# EAGLE design SAML21 Feather (EAGLE 9.4.2)
COMPANY: ADAFRUIT INDUSTRIES; DRAWN: KTOWN; REV: B
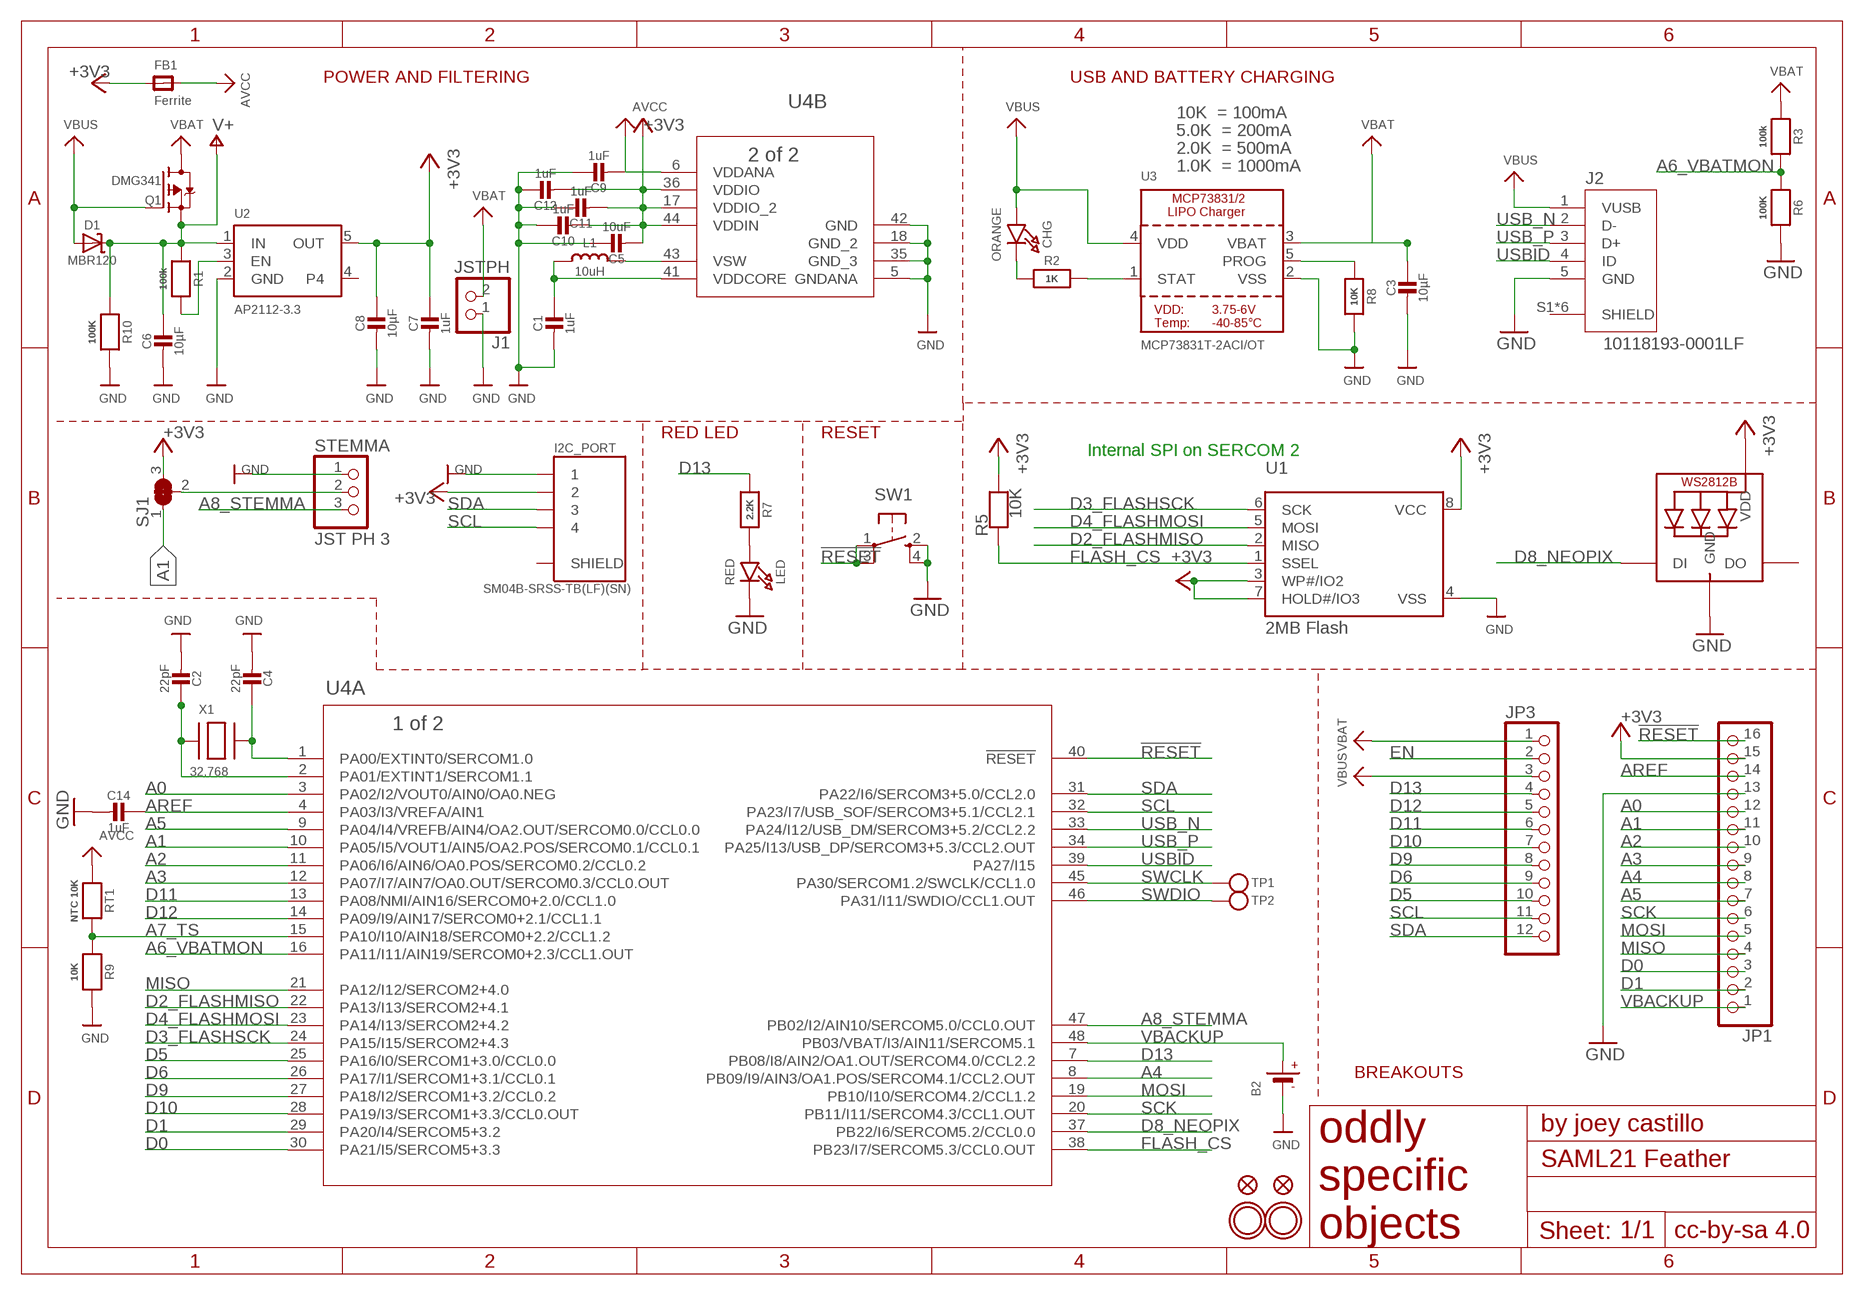
[diagram p0: schematic, sheet 1]

## Parts
B2  CR1220  BATTERYCR1220_2  [CR1220-2]
C1  1uF  CAP_CERAMIC0805-NOOUTLINE  [0805-NO]
C2  22pF  CAP_CERAMIC0805-NOOUTLINE  [0805-NO]
C3  10µF  CAP_CERAMIC0805-NOOUTLINE  [0805-NO]
C4  22pF  CAP_CERAMIC0805-NOOUTLINE  [0805-NO]
C5  10uF  CAP_CERAMIC0805-NOOUTLINE  [0805-NO]
C6  10µF  CAP_CERAMIC0805-NOOUTLINE  [0805-NO]
C7  1uF  CAP_CERAMIC0805-NOOUTLINE  [0805-NO]
C8  10µF  CAP_CERAMIC0805-NOOUTLINE  [0805-NO]
C9  1uF  CAP_CERAMIC0805-NOOUTLINE  [0805-NO]
C10  1uF  CAP_CERAMIC0805-NOOUTLINE  [0805-NO]
C11  1uF  CAP_CERAMIC0805-NOOUTLINE  [0805-NO]
C12  1uF  CAP_CERAMIC0805-NOOUTLINE  [0805-NO]
C14  1uF  CAP_CERAMIC0805-NOOUTLINE  [0805-NO]
CHG  ORANGE  LED0805_NOOUTLINE  [CHIPLED_0805_NOOUTLINE]
D1  MBR120  DIODE-SCHOTTKYSOD-123  [SOD-123]
FB1  Ferrite  FERRITE0805  [0805]
I2C_PORT  SM04B-SRSS-TB(LF)(SN)  [JST_SM04B-SRSS-TB(LF)(SN)]
J1  JSTPH  CON_JST_PH_2PIN  [JSTPH2]
J2  10118193-0001LF  [FCI_10118193-0001LF]
JP1  HEADER-1X16ROUND  [1X16_ROUND]
JP3  HEADER-1X12  [1X12_ROUND]
L1  10uH  MICROBUILDER_INDUCTORNR401_BIGPADS  [MICROBUILDER_INDUCTOR_4X4MM_NR401_BIGPADS]
LED  RED  LED0805_NOOUTLINE  [CHIPLED_0805_NOOUTLINE]
NEOPIX  WS2812B3535  [LED3535]
Q1  DMG341  MOSFET-P  [SOT23-R]
R1  100k  RESISTOR0805_NOOUTLINE  [0805-NO]
R2  1K  RESISTOR0805_NOOUTLINE  [0805-NO]
R3  100k  RESISTOR0805_10MGAP  [0805_10MGAP]
R5  10K  RESISTOR0805_NOOUTLINE  [0805-NO]
R6  100K  RESISTOR0805_NOOUTLINE  [0805-NO]
R7  2.2K  RESISTOR0805_NOOUTLINE  [0805-NO]
R8  10K  RESISTOR0805_NOOUTLINE  [0805-NO]
R9  10K  RESISTOR0805_NOOUTLINE  [0805-NO]
R10  100K  RESISTOR0805_NOOUTLINE  [0805-NO]
RT1  NTC 10K  RESISTOR0805_NOOUTLINE  [0805-NO]
SJ1  SOLDERJUMPER_2WAY  [SOLDERJUMPER_2WAY_OPEN_NOPASTE]
STEMMA  JST PH 3  CON_JST_PH_3PIN  [JSTPH3]
SW1  SPST_TACT-KMR2  [KMR2]
TP1  TESTPOINTROUND1.5MM  [TESTPOINT_ROUND_1.5MM]
TP2  TESTPOINTROUND1.5MM  [TESTPOINT_ROUND_1.5MM]
U1  2MB Flash  SPIFLASH_SOIC8208MIL  [SOIC8_208MIL]
U2  AP2112-3.3  VREG_SOT23-5  [SOT23-5]
U3  MCP73831T-2ACI/OT  MCP73831/2  [SOT23-5]
U4  ATSAML21G16B-ANT  [TQFP48_7X7MC]
U$31  MOUNTINGHOLE2.5  [MOUNTINGHOLE_2.5_PLATED]
U$32  MOUNTINGHOLE2.5  [MOUNTINGHOLE_2.5_PLATED]
U$34  FIDUCIAL""  [FIDUCIAL_1MM]
U$35  FIDUCIAL""  [FIDUCIAL_1MM]
X1  32.768  XTAL-3.2X1.5  [XTAL3215]

## Nets
!RESET: JP1.16 SW1.1(P) SW1.3(P1) U4.40(A:!RESET)
+3V3 [power]: C5.2 C7.1 C8.1 C10.2 C11.2 C12.2 FB1.1 I2C_PORT.2 JP1.15 NEOPIX.2(VDD) R5.2 SJ1.3 U1.3(WP#/IO2) U1.7(HOLD#/IO3) U1.8(VCC) U2.5(OUT) U4.17(B:VDDIO_2) U4.36(B:VDDIO) U4.44(B:VDDIN)
A0: JP1.12 U4.3(A:PA02/I2/VOUT0/AIN0/OA0.NEG)
A1: JP1.11 SJ1.1 U4.10(A:PA05/I5/VOUT1/AIN5/OA2.POS/SERCOM0.1/CCL0.1)
A2: JP1.10 U4.11(A:PA06/I6/AIN6/OA0.POS/SERCOM0.2/CCL0.2)
A3: JP1.9 U4.12(A:PA07/I7/AIN7/OA0.OUT/SERCOM0.3/CCL0.OUT)
A4: JP1.8 U4.8(A:PB09/I9/AIN3/OA1.POS/SERCOM4.1/CCL2.OUT)
A5: JP1.7 U4.9(A:PA04/I4/VREFB/AIN4/OA2.OUT/SERCOM0.0/CCL0.0)
A6_VBATMON: R3.2 R6.1 U4.16(A:PA11/I11/AIN19/SERCOM0+2.3/CCL1.OUT)
A7_TS: R9.1 RT1.2 U4.15(A:PA10/I10/AIN18/SERCOM0+2.2/CCL1.2)
A8_STEMMA: STEMMA.3 U4.47(A:PB02/I2/AIN10/SERCOM5.0/CCL0.OUT)
AREF: C14.1 JP1.14 U4.4(A:PA03/I3/VREFA/AIN1)
AVCC: C9.2 FB1.2 RT1.1 U4.6(B:VDDANA)
D0: JP1.3 U4.30(A:PA21/I5/SERCOM5+3.3)
D1: JP1.2 U4.29(A:PA20/I4/SERCOM5+3.2)
D2_FLASHMISO: U1.2(MISO) U4.22(A:PA13/I13/SERCOM2+4.1)
D3_FLASHSCK: U1.6(SCK) U4.24(A:PA15/I15/SERCOM2+4.3)
D4_FLASHMOSI: U1.5(MOSI) U4.23(A:PA14/I13/SERCOM2+4.2)
D5: JP3.10 U4.25(A:PA16/I0/SERCOM1+3.0/CCL0.0)
D6: JP3.9 U4.26(A:PA17/I1/SERCOM1+3.1/CCL0.1)
D8_NEOPIX: NEOPIX.1(DI) U4.37(A:PB22/I6/SERCOM5.2/CCL0.0)
D9: JP3.8 U4.27(A:PA18/I2/SERCOM1+3.2/CCL0.2)
D10: JP3.7 U4.28(A:PA19/I3/SERCOM1+3.3/CCL0.OUT)
D11: JP3.6 U4.13(A:PA08/NMI/AIN16/SERCOM0+2.0/CCL1.0)
D12: JP3.5 U4.14(A:PA09/I9/AIN17/SERCOM0+2.1/CCL1.1)
D13: JP3.4 R7.1 U4.7(A:PB08/I8/AIN2/OA1.OUT/SERCOM4.0/CCL2.2)
EN: JP3.2 R1.2 U2.3(EN)
FLASH_CS: R5.1 U1.1(SSEL) U4.38(A:PB23/I7/SERCOM5.3/CCL0.OUT)
GND [gnd]: B2.- C1.2 C2.2 C3.2 C4.2 C5.1 C6.2 C7.2 C8.2 C9.1 C10.1 C11.1 C12.1 C14.2 I2C_PORT.1 J1.1 J2.5(GND) JP1.13 LED.C NEOPIX.4(GND) R6.2 R8.2 R9.2 R10.2 STEMMA.1 SW1.2(S) SW1.4(S1) U1.4(VSS) U2.2(GND) U3.2(VSS) U4.5(B:GNDANA) U4.18(B:GND_2) U4.35(B:GND_3) U4.42(B:GND)
MISO: JP1.4 U4.21(A:PA12/I12/SERCOM2+4.0)
MOSI: JP1.5 U4.19(A:PB10/I10/SERCOM4.2/CCL1.2)
N$1: CHG.C R2.1
N$2: LED.A R7.2
N$3: SJ1.2 STEMMA.2
PROG: R8.1 U3.5(PROG)
SCK: JP1.6 U4.20(A:PB11/I11/SERCOM4.3/CCL1.OUT)
SCL: I2C_PORT.4 JP3.11 U4.32(A:PA23/I7/USB_SOF/SERCOM3+5.1/CCL2.1)
SDA: I2C_PORT.3 JP3.12 U4.31(A:PA22/I6/SERCOM3+5.0/CCL2.0)
STAT: R2.2 U3.1(STAT)
SWCLK: TP1.P$1 U4.45(A:PA30/SERCOM1.2/SWCLK/CCL1.0)
SWDIO: TP2.P$1 U4.46(A:PA31/I11/SWDIO/CCL1.OUT)
USB_N: J2.2(D-) U4.33(A:PA24/I12/USB_DM/SERCOM3+5.2/CCL2.2)
USB_P: J2.3(D+) U4.34(A:PA25/I13/USB_DP/SERCOM3+5.3/CCL2.OUT)
USBID: J2.4(ID) U4.39(A:PA27/I15)
V+ [power]: C6.1 D1.C Q1.2(S) R1.1 R10.1 U2.1(IN)
VBACKUP: B2.+ JP1.1 U4.48(A:PB03/VBAT/I3/AIN11/SERCOM5.1)
VBAT [power]: C3.1 J1.2 JP3.1 Q1.3(D) R3.1 U3.3(VBAT)
VBUS [power]: CHG.A D1.A J2.1(VUSB) JP3.3 Q1.1(G) U3.4(VDD)
VDDCORE: C1.1 L1.P$1 U4.41(B:VDDCORE)
VSW: L1.P$2 U4.43(B:VSW)
XIN32: C4.1 U4.1(A:PA00/EXTINT0/SERCOM1.0) X1.P$2
XOUT32: C2.1 U4.2(A:PA01/EXTINT1/SERCOM1.1) X1.P$1
Unconnected: I2C_PORT.S1(SHIELD) I2C_PORT.S2(SHIELD) J2.S1(SHIELD) J2.S2(SHIELD) J2.S3(SHIELD) J2.S4(SHIELD) J2.S5(SHIELD) J2.S6(SHIELD) NEOPIX.3(DO) U2.4

## Notes on the sheet
- POWER AND FILTERING | USB AND BATTERY CHARGING
- 10K  = 100mA
- 5.0K  = 200mA
- 2.0K  = 500mA
- 1.0K  = 1000mA
- RED LED | RESET
- Internal SPI on SERCOM 2
- BREAKOUTS

## Library data of the parts
B2 = microbuilder:BATTERY: CR1220 SMT - Digikey: 3001K-ND CD2032 BAT-HLD-001 - Digikey: BAT-HLD-001-ND
C1-C12 C14 = microbuilder:CAP_CERAMIC: Ceramic Capacitors For new designs, use the packages preceded by an '_' character since they are more reliable: The following footprints should be used on most boards: _0402 - Standard footprint for regular board layouts _0603 - Standard footprint for regular board layouts _0805 - Standard footprint for regular board layouts _1206 - Standard footprint for regular board layouts For extremely tight-pitch boards where space is at a premium, the following 'micro-pitch' footprints can be used (smaller pads, no silkscreen outline, etc.): _0402MP - Micro-pitch footprint for very dense/compact boards _0603MP - Micro-pitch footprint for very dense/compact boards _0805MP - Micro-pitch footprint for very dense/compact boards _1206MP - Micro-pitch footprint for very dense/compact boards
CHG LED = microbuilder:LED: LED 0603 - 0603 Surface Mount Package 2mA: Green LED - Low Power (3.9mcd, 2ma, 1.7Vf) - Digikey: 475-2709-2-ND Orange LED - Low Power (9.8mcd, 2ma, 1.8Vf) - Digikey: 475-1194-2-ND Red LED - Low Power (5mcd, 2ma, 1.8Vf) - Digikey: 475-1195-2-ND Yellow LED - Low Power (7mcd, 2ma, 1.8Vf) - Digikey: 475-1196-2-ND 5mA: Blue LED - Low Power (17mcd, 5ma, 2.9Vf) - Digikey: LNJ937W8CRACT-ND 0805 - 0805 Surface Mount Package 2mA: Red LED (8.8mcd, 2mA, 1.8Vf, Clear) - Low Power [Digikey: 475-2510-1-ND] Green LED (5mcd, 2mA, 1.8Vf, Clear) - Low Power [Digikey: 475-2730-1-ND] Yellow LED (11.3mcd, 2mA, 1.8Vf, Clear) - Low Power [Digikey: 475-2555-1-ND] 20mA: Red LED (104mcd, 20mA, Diffused) - LS R976 [Digikey: 475-1278-6-ND] Red LED (12mcd, 20mA, 2.0Vf, Clear) - APT2012EC [Digikey: 754-1128-1-ND] Green LED (15mcd, 20mA, 2.2Vf, Clear) - APT2012GC [Digikey: 754-1131-1-ND] Orange LED (160mcd, 20mA, 2.1Vf, Clear) - APT2012SECK [Digikey: 754-1130-1-ND] 1206 - 1206 Surface Mount Package Green LED (26mcd, 20mA, Diffused) - LG N971 [Digikey: 475-1407-6-ND] Red LED (15mcd, 20mA, Diffused) - LH N974 [Digikey: 475-1416-6-ND] Cree - Cree High-Power Surface Mount LEDs XPEBWT-L1-0000-00D50 - White 111lm 350mA 2.9Vf 6200K 110° XTEAWT-00-0000-00000LEE3 - White 114lm 350mA 2.85Vf 5000K 115° Everlight - Everlight 45-21 Series Surface Mount LEDs 45-21/QK2C-B2832AC2CB2/2T - Warm White 2000mcd 20mA 3.25Vf 3050K 120° 45-21/LK2C-B38452C4CB2/2T - Nuetral White 2000mcd 20mA 3.25Vf 4150K 120° 45-21/LK2C-B50634C6CB2/2T - Cold White 2200mcd 20mA 3.25Vf 5650K 120° PLCC2 Reverse Mount LS T77K-J1L2-1-0-2-R18-Z - Red 11.25mcd 2mA 1.8Vf 630nm 120° LO T77K-L1M2-24-Z - Orange 19.6mcd 2mA 1.8Vf 606nm 120° LY T77K-K2M1-26-Z - Yellow 15.7mcd 2mA 1.8Vf 587nm 120°
D1 = microbuilder:DIODE-SCHOTTKY
FB1 = microbuilder:FERRITE: Ferrite Bead 0603 MMZ1608B121C - 120 Ohm @ 100MHz, 600mA, 0.15 Ohm DC Resistance - Digikey: 445-2164-1-ND BK1608HW121-T - 120 Ohm, 600mA Ferrite Chip - Digikey: 587-1876-2-ND 0805 HZ0805B272R-10 - 2.7K Ohm @ 100MHz, 200mA, 0.8 Ohm DC Resistance - Digikey: 240-2504-1-ND (see also Murata BLM21BD272SN1L) MMZ2012Y152B - 1.5K Ohm @ 100MHz, 500mA, 0.4 Ohm DC Resistance - Digikey: 445-1560-1-ND - Mainly for high frequency (80-400MHz) MMZ2012R102A - 1K Ohm @ 100MHz, 500mA, 0.3 Ohm DC Resistance - Digikey: 445-1555-2-ND - More general purpose (10-200MHz)
I2C_PORT = SM04B-SRSS-TB_LF__SN_:SM04B-SRSS-TB(LF)(SN): SH Series 1.0 mm Pitch 2 Position Single Row Side Entry Shrouded Header; DESCRIPTION: SH Series 1.0 mm Pitch 2 Position Single Row Side Entry Shrouded Header; DIGI-KEY_PART_NUMBER: 455-1804-1-ND; DIGI-KEY_PURCHASE_URL: https://www.digikey.com/product-detail/en/jst-sales-america-inc/SM04B-SRSS-TB_LF__SN_/455-1804-1-ND/926875?utm_source=snapeda&utm_medium=aggregator&utm_campaign=symbol; MF: JST Sales; MP: SM04B-SRSS-TB_LF__SN_; PACKAGE: None
J1 = microbuilder:CON_JST_PH_2PIN: JST 2-Pin Right-Angle Connector PH-Series - 4UConnector: 17311 SH-Series - 4UConnector: 07278
J2 = 10118193-0001LF:10118193-0001LF: Micro USB B Type Receptacle; DESCRIPTION: Single Port 5 Contact Shielded SMT MICRO USB B-Type Receptacle; DIGI-KEY_PART_NUMBER: 609-4616-1-ND; DIGI-KEY_PURCHASE_URL: https://www.digikey.com/product-detail/en/amphenol-icc-fci/10118193-0001LF/609-4616-1-ND/2785380?utm_source=snapeda&utm_medium=aggregator&utm_campaign=symbol; MF: Amphenol ICC; MP: 10118193-0001LF; PACKAGE: None
JP1 = microbuilder:HEADER-1X16: PIN HEADER
JP3 = microbuilder:HEADER-1X12
L1 = Adafruit 3.5in 480x320 FeatherWing:MICROBUILDER_INDUCTOR: Inductors 0603: 10nH Ceramic Inductor - microwire antenna/RF (Digikey: 712-1434-2-ND) 0805: 560nH Ceramic Inductor - RF (Digikey: 553-1047-1-ND) 270nH Ceramic Inductor - Q = 40@250MHz, +-5%, 1 Ohm DC Resistance (Digikey: 535-10506-2-ND) 1007 (2518 Metric) SMT: 10µH 10% 250mOhm 820mA 1007 Inductor (Digikey: 587-2189-1-ND) 22µH 10% 500mOhm 580mA 1007 Inductor (Digikey: 587-2190-1-ND) 47µH 10% 950mOhm 420mA 1007 Inductor (Digikey: 587-2191-1-ND) 47µH 5% 100mOhm 1A 1008 Inductor (Digikey: 732-1816-1-ND) 5.0x5.0mm (Taiyo Yuden NR5040 Series) 6.8µH 20% 2.3A 64mOhm Inductor (Digikey: 587-2374-2-ND) 5.0x5.0mm (TDK VLC5045 Series) 4.7µH 20% 3.3A 34mOhm Inductor (Digikey: 445-6526-1-ND) 6.8µH 20% 2.7A 46mOhm Inductor (Digikey: 445-6527-1-ND) 6.0x6.0mm (TDK VLC6045 Series) 4.7µH 20% 3.8A 27mOhm Inductor (Digikey: 445-6538-2-ND) 6.8µH 20% 3A 41mOhm Inductor (Digikey: 445-6540-1-ND) 6.2µH 30% 2.2A 45mOhm Inductor (Digikey: SRR5028-6R2YCT-ND) - Not TDK VLC6045 but footprint should match 6.0x6.0mm (TDK SLF6045 Series) 6.8uH 30% 2A 33mOhm Inductor (Digikey: 445-4572-1-ND, Mouser: 810-SLF645T6R8N2R0PF) 6.0x6.0mm (Sumida CDRH5D28 Series) 6.2uH 30% 1.8A 45mOhm Inductor (Digikey: 308-1542-1-ND) Taiyo Yuden NR3015T2R2M - 2.2uH 20% 1.5A (Digikey: 587-1648-2-ND, Mouser: 963-NR3015T2R2M) - Used with TI TPS62172 CoilCraft RFID Transponder Coil - MA5532-AE (For use with AS3935 Lightning Sensor) Taiyo Yuden NRH2412T2R2MNGH - 2.2uH 20% 1AA (Digikey: 587-3443-1-ND) - Used with TI LM3671 Vishay IHLP 1.0uH Molded Inductor - 24mOhm DCR, 5A, +/-20%, -55°C-125°C (Digikey: 541-1319-1-ND)
NEOPIX = microbuilder:WS2812B
Q1 = microbuilder:MOSFET-P: P-Channel Mosfet LEGEND VDS: Voltage Drain-Source ID: Drain Current RDS(ON): Drain-Source On-State Resistance VGS(TH): Gate-Source Threshold Voltage CISS: Drain-Source Input Capacitance SOT-23 Name VDS ID RDS(ON) VGS(TH) CISS Order Number IRLML5103 30V 760mA 600 mOhm -- 75pF @ 25V Digikey: IRLML5103PBFCT-ND IRLML6401 12V 4.3A 50 mOhm 950mV @ 250µA 830pF @ 10V Digikey: IRLML6401PBFTR-ND NTR0202PL 20V 400mA 800 mOhm 2.3V @ 250uA 70pF @ 5V Digikey: NTR0202PLT1GOSTR-ND NTR4101PT1G 20V 1.8A 85 mOhm 1.2V @ 250uA 675pF @ 10V Digikey: NTR4101PT1GOSCT-ND DMP2004K 20V 600mA 900 mOhm 1V @ 250uA 175pF @ 16V Digikey: DMP2004KDICT-ND PMV65XP 20V 3.9A 76 mOhm 950mV @ 1mA 725pF @ 20V Digikey: 568-2358-2-ND TO-252 Name VDS ID RDS(ON) VGS(TH) CISS Order Number AOD417 30V 25A 34 mOhm 3V @ 250µA 920pF @ 15V Digikey: 785-1106-2-ND PowerPak Name VDS ID RDS(ON) VGS(TH) CISS Order Number AON7401 30V 12A 14 mOhm 3V @ 250µA 2600pF @ 15V Digikey: 785-1302-1-ND
R1-R3 R5-R10 RT1 = microbuilder:RESISTOR: Resistors For new designs, use the packages preceded by an '_' character since they are more reliable: The following footprints should be used on most boards: _0402 - Standard footprint for regular board layouts _0603 - Standard footprint for regular board layouts _0805 - Standard footprint for regular board layouts _1206 - Standard footprint for regular board layouts For extremely tight-pitch boards where space is at a premium, the following 'micro-pitch' footprints can be used (smaller pads, no silkscreen outline, etc.): _0402MP - Micro-pitch footprint for very dense/compact boards _0603MP - Micro-pitch footprint for very dense/compact boards _0805MP - Micro-pitch footprint for very dense/compact boards _1206MP - Micro-pitch footprint for very dense/compact boards
SJ1 = pygamer-microbuilder:SOLDERJUMPER_2WAY: 2-Way Solder Jumper
STEMMA = microbuilder:CON_JST_PH_3PIN
SW1 = adafruit:SPST_TACT: SMT 6mm switch, EVQQ2 series http://www.ladyada.net/library/eagle
TP1 TP2 = microbuilder:TESTPOINT: Test Point Various test points for characterisation and PCB testing TESTPOINT_SMT - Compact Surface Mount Test Point [Digikey: 5016KTR-ND]
U1 = microbuilder:SPIFLASH_SOIC8: SOIC8 SPI Flash Be careful with the size since SOIC8 flash comes in several 'widths' SOIC8 150 mil M25P16 - 16Mbit (2Mbit x 8) Serial Flash (75MHz SPI Bus), Supply: 2.7-3.6V Digikey: SOIC8 - M25P16-VMN6P-ND SOIC8 208 mil W25Q16BVSSIG - 16Mbit (2Mbit x 8) Serial Flash (104MHz SPI Bus), Supply: 2.7-3.6V Digikey: SOIC8 - W25Q16BVSSIG-ND
U2 = microbuilder:VREG_SOT23-5: SOT23-5 Fixed Voltage Regulators Part Current Out V Out V In V Dropout θJA (°C/W) TJ (°C) Digikey Part No. ADP121 150mA 3.3V 3.4-5.5V 0.09V @ 150mA -- -- ADP121-AUJZ33R7CT-ND ADP121 150mA 3.0V 3.1-5.5V 0.09V @ 150mA -- -- ADP121-AUJZ30R7CT-ND ADP122 300mA 3.3V 3.4-5.5V 0.085V @ 300mA -- -- ADP122AUJZ-3.3-R7CT-ND ADP1712 300mA 3.3V 3.5-5.5V 0.17V @ 300mA -- -- ADP1712AUJZ-3.3-R7TR-ND AP7311 (Low Cost) 150mA 3.3V 3.5-6V 0.15V @ 150mA -- -- AP7311-33WG-7DICT-ND LD39015M18R 150mA 1.8V 1.9V-5.5V 0.08V @ 100mA -- -- 497-6977-1-ND LP2985A-33DBVR 150mA 3.3V 3.3-16V 0.28V @ 150mA 206 150 296-18479-1-ND MCP1824T-3302E/OT 300mA 3.3V 3.5V-6V 0.2V @ 300mA -- -- MCP1824T-3302E/OTCT-ND MIC5205-2.5YM5 TR 150mA 2.5V 2.7-16V 0.165V @ 150mA -- -- 576-1257-2-ND MIC5205-3.0YM5 TR 150mA 3.0V 3.2V-16V 0.165V @ 150mA -- -- 576-1258-2-ND MIC5205-3.3YM5 TR 150mA 3.3V 3.5V-16V 0.165V @ 150mA -- -- 576-1259-2-ND TPS780330220 150mA 3.3V+2.2V 3.6-5.5V 250mV Max -- -- 296-23332-1-ND TDA3663/N1,135 100mA 3.3V 3.5-45V 0.18V @ 50mA -- -- 568-5343-1-ND Max operating temp can be calculated using θJA, TJ (max junction temperature), and power in watts. Set the "Maximum Ambient Temperature" until it reaches TJ ("Max Junction Temperature"), which is the absolute limit for safe use of the regulator: Heat Sink Temperature Calculator <http://www.daycounter.com/Calculators/Heat-Sink-Temperature-Calculator.phtml> For example, With 12V source into a 3.3V LP2985 and a 30mA load, we are dissipating (12V-3.3V) * 0.03A = 0.261W. With a θJA of 206 °C/W, a TJ of 150°C, and 261mW we can safely use the chip without a heat sink up to 75°C (=147.1°C Junction Temperature).
U3 = microbuilder:MCP73831/2: MCP73831/2 LIPO Charger VDD: 3.75 - 6V Temp -40 - 85°C Programmable Charge Rate: 15-500mA NOTE: STAT is a tri-state logic output on the MCP73831 and an open-drain output on the MCP73832. SOT23-5 with 4.2V output and tri-state logic on STAT = MCP73831T-2ACI/OT
U4 = My Stuff:ATSAML21G16B-ANT; BUILT_BY: EMA_Molly; COPYRIGHT: Copyright (C) 2018 Accelerated Designs. All rights reserved; MANUFACTURER_PART_NUMBER: ATSAML21G16B-ANT; VENDOR: Microchip
U$31 U$32 = microbuilder:MOUNTINGHOLE: Mounting Hole For #2 screws (0.086"/2.18mm width, 0.094"/2.4mm hole) use 2.5mm; BOM: EXCLUDE
U$34 U$35 = microbuilder:FIDUCIAL: Fiducial Alignment Points Various fiducial points for machine vision alignment.; BOM: EXCLUDE
X1 = adafruit2:XTAL: Low cost SMT crystals, no capacitors included http://www.ladyada.net/library/eagle

## Net classes
0 default: width 0.152 mm, drill 0.254 mm
1 power: width 0.305 mm, drill 0.305 mm

## Board
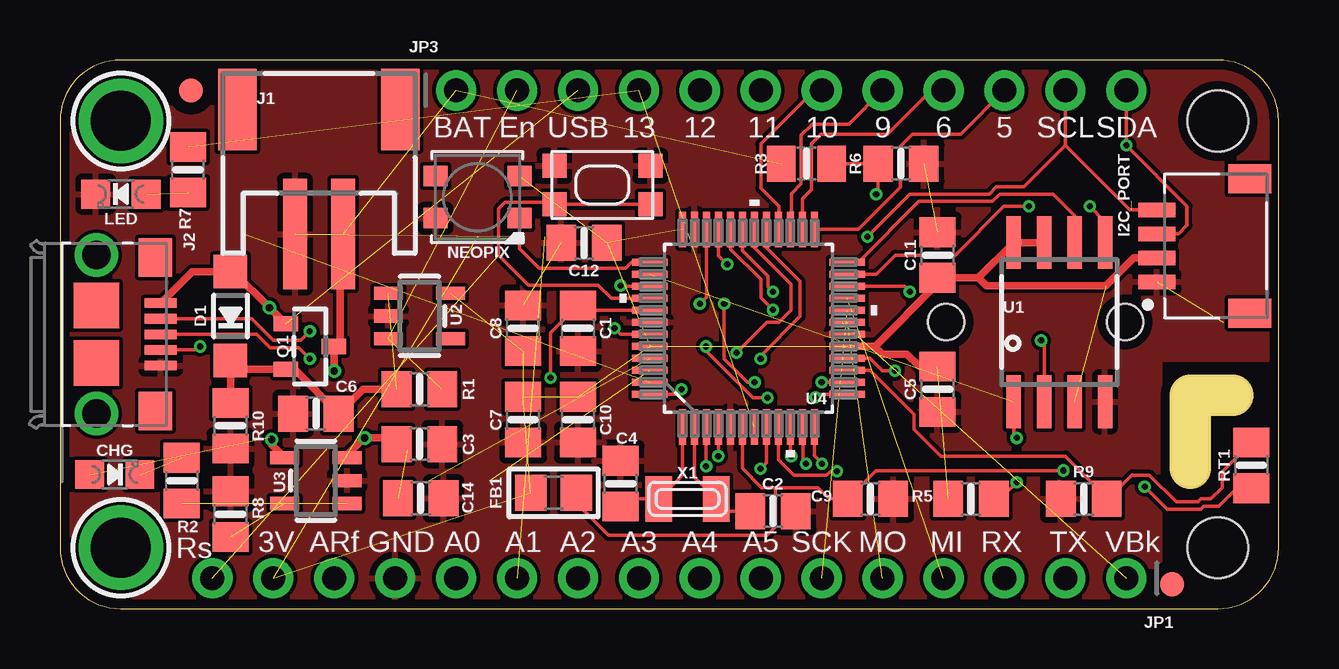
[diagram p1: board, top side]
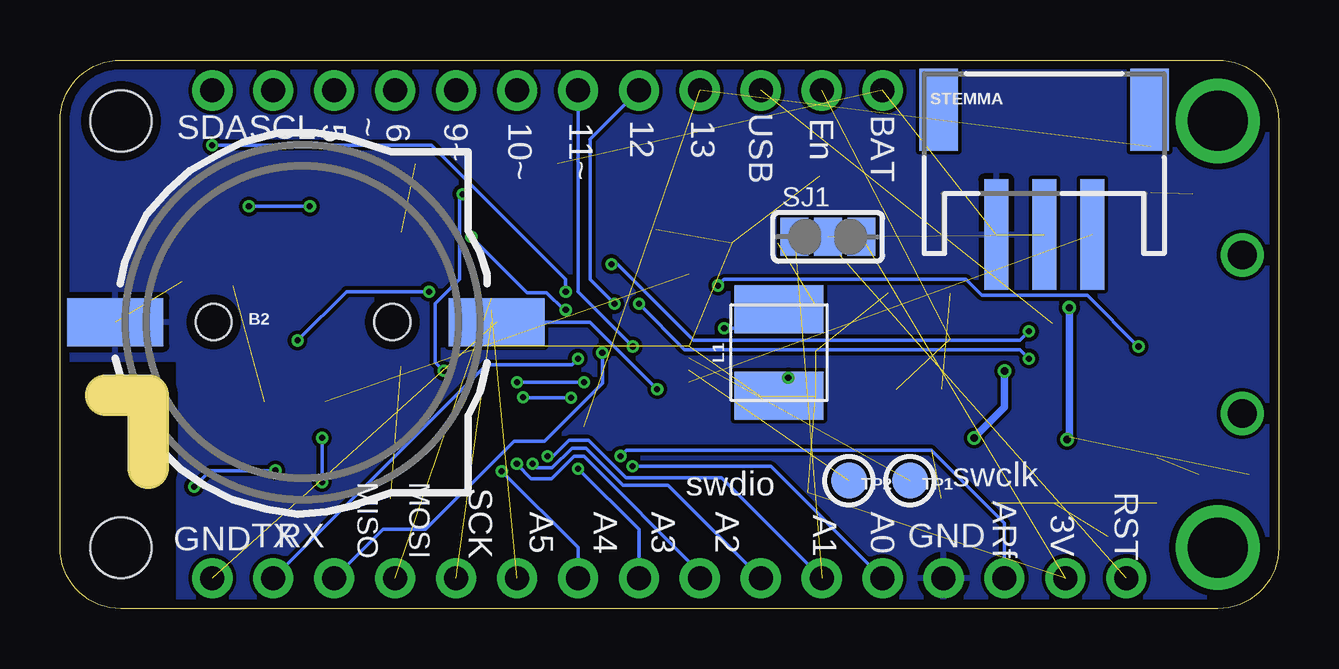
[diagram p2: board, bottom side, seen from below]

Size 50.8 x 22.86 mm. Coordinates in mm from the lower left corner, seen from the top.
Outline: 47.12,5.84 47.12,8.89 48.9,8.89
Outline: 2.54,0 48.26,0 arc90 50.8,2.54 50.8,20.32 arc90 48.26,22.86 2.54,22.86 arc90 0,20.32 0,2.54 arc90 2.54,0
Copper layers (1*16): Top 0.035559375mm / dielectric 1.6mm / Bottom 0.035559375mm
Design rules "oshpark-2layer": minimum track width 6mil, minimum drill 10mil, track to track 6mil, track to pad 6mil, pad to pad 6mil, via to via 6mil, smd to smd 6mil, copper to edge 15mil, drill to drill 6mil, minimum pad ring 5mil, minimum via ring 5mil, stop-mask expansion 2.5mil, vias tented up to drill 0mil, thermal gap 10mil
Holes 2.54 mm at 48.26,20.32 48.26,2.54
Milling: 2 lines

### Footprints (pad centres in the part's own frame; a part is rotated, then mirrored left to right if it is on the bottom)
CR1220-2 = smd 4 x 2: + 8.29,0; - -7.6,0 | hole 1.5: 3.95,0; -3.5,0
0805-NO = smd 1.24 x 1.5: 1 -0.95,0; 2 0.95,0
CHIPLED_0805_NOOUTLINE = smd 1.2 x 1.2: A 0,-1.05; C 0,1.05
SOD-123 = smd 1.4 x 1.4: A 1.85,0; C -1.85,0
0805 = smd 1.3 x 1.5: 1 -0.95,0; 2 0.95,0
JST_SM04B-SRSS-TB(LF)(SN) = smd 0.6 x 1.55: 1 -1.5,0; 2 -0.5,0; 3 0.5,0; 4 1.5,0 | smd 1.2 x 1.8: S1 -2.8,-3.875; S2 2.8,-3.875
JSTPH2 = smd 1 x 4.6: 1 -1,-3.7; 2 1,-3.7 | smd 1.6 x 3.4: NC1 -3.4,1.5; NC2 3.4,1.5
FCI_10118193-0001LF = smd 0.4 x 1.35: 1 -1.3,2.675; 2 -0.65,2.675; 3 0,2.675; 4 0.65,2.675; 5 1.3,2.675 | smd 1.6 x 1.4: S1 -3.2,2.45; S2 3.2,2.45 | smd 1.9 x 1.9: S3 1.2,0; S4 -1.2,0 | drill 1.2: S5 3.302,0; S6 -3.302,0
1X16_ROUND = drill 1 pad 1.676: 1 -19.05,0; 2 -16.51,0; 3 -13.97,0; 4 -11.43,0; 5 -8.89,0; 6 -6.35,0; 7 -3.81,0; 8 -1.27,0; 9 1.27,0; 10 3.81,0; 11 6.35,0; 12 8.89,0; 13 11.43,0; 14 13.97,0; 15 16.51,0; 16 19.05,0
1X12_ROUND = drill 1 pad 1.676: 1 -13.97,0; 2 -11.43,0; 3 -8.89,0; 4 -6.35,0; 5 -3.81,0; 6 -1.27,0; 7 1.27,0; 8 3.81,0; 9 6.35,0; 10 8.89,0; 11 11.43,0; 12 13.97,0
MICROBUILDER_INDUCTOR_4X4MM_NR401_BIGPADS = smd 2 x 3.7: P$1 -1.8,0; P$2 1.8,0
LED3535 = smd 1 x 0.85: 1 -1.75,0.875; 2 -1.75,-0.875; 3 1.75,-0.875; 4 1.75,0.875
SOT23-R = smd 0.635 x 1.016: 1 -0.95,-1; 2 0.95,-1; 3 0,1
0805_10MGAP = smd 1.2 x 1.5: 1 -1.05,0; 2 1.05,0
SOLDERJUMPER_2WAY_OPEN_NOPASTE = smd 1.168 x 1.6: 1 -1.397,0; 2 0,0; 3 1.397,0
JSTPH3 = smd 1 x 4.6: 1 -2,-2.7; 2 0,-2.7; 3 2,-2.7 | smd 1.6 x 3.4: NC1 -4.4,2.5; NC2 4.4,2.5
KMR2 = smd 1 x 1: 1 2,0.8; 2 2,-0.8; 3 -2,0.8; 4 -2,-0.8
TESTPOINT_ROUND_1.5MM = smd 1.5 x 1.5: P$1 0,0
SOIC8_208MIL = smd 0.6 x 2.2: 1 -1.905,-3.315; 2 -0.635,-3.315; 3 0.635,-3.315; 4 1.905,-3.315; 5 1.905,3.315; 6 0.635,3.315; 7 -0.635,3.315; 8 -1.905,3.315
SOT23-5 = smd 0.55 x 1.2: 1 -0.95,-1.3; 2 0,-1.3; 3 0.95,-1.3; 4 0.95,1.3; 5 -0.95,1.3
TQFP48_7X7MC = smd 1.473 x 0.279: 1 -4.115,2.75; 2 -4.115,2.25; 3 -4.115,1.75; 4 -4.115,1.25; 5 -4.115,0.75; 6 -4.115,0.25; 7 -4.115,-0.25; 8 -4.115,-0.75; 9 -4.115,-1.25; 10 -4.115,-1.75; 11 -4.115,-2.25; 12 -4.115,-2.75; 25 4.115,-2.75; 26 4.115,-2.25; 27 4.115,-1.75; 28 4.115,-1.25; 29 4.115,-0.75; 30 4.115,-0.25; 31 4.115,0.25; 32 4.115,0.75; 33 4.115,1.25; 34 4.115,1.75; 35 4.115,2.25; 36 4.115,2.75 | smd 0.279 x 1.473: 13 -2.75,-4.115; 14 -2.25,-4.115; 15 -1.75,-4.115; 16 -1.25,-4.115; 17 -0.75,-4.115; 18 -0.25,-4.115; 19 0.25,-4.115; 20 0.75,-4.115; 21 1.25,-4.115; 22 1.75,-4.115; 23 2.25,-4.115; 24 2.75,-4.115; 37 2.75,4.115; 38 2.25,4.115; 39 1.75,4.115; 40 1.25,4.115; 41 0.75,4.115; 42 0.25,4.115; 43 -0.25,4.115; 44 -0.75,4.115; 45 -1.25,4.115; 46 -1.75,4.115; 47 -2.25,4.115; 48 -2.75,4.115
MOUNTINGHOLE_2.5_PLATED = drill 2.5 pad 3.2: P$1 0,0
FIDUCIAL_1MM = smd 1 x 1: 1 0,0
XTAL3215 = smd 1.1 x 1.9: P$1 1.2,0; P$2 -1.2,0

### Placement (x,y rotation side)
B2  40.89,11.94 0 bottom
C1  21.59,11.68 270 top
C2  29.72,4.06 0 top
C3  14.99,6.86 0 top
C4  23.37,5.21 90 top
C5  36.58,9.14 90 top
C6  10.67,8.13 180 top
C7  19.3,7.87 270 top
C8  19.3,11.68 90 top
C9  33.78,4.57 180 top
C10  21.59,7.87 90 top
C11  36.58,14.73 270 top
C12  21.84,15.24 0 top
C14  15.04,4.6 0 top
CHG  2.29,5.59 270 top
D1  7.11,12.19 90 top
FB1  20.57,4.83 0 top
I2C_PORT  45.72,15.11 90 top
J1  10.79,19.3 0 top
J2  1.52,11.43 270 top
JP1  25.4,1.27 180 top
JP3  30.48,21.59 0 top
L1  20.83,10.67 90 bottom
LED  2.54,17.27 90 top
NEOPIX  17.4,17.14 180 top
Q1  10.41,10.92 270 top
R1  14.99,9.14 0 top
R2  5.08,5.33 270 top
R3  31.11,18.54 0 top
R5  37.97,4.57 180 top
R6  35.05,18.54 0 top
R7  5.33,18.29 270 top
R8  7.11,3.94 90 top
R9  42.67,4.57 180 top
R10  7.11,7.62 270 top
RT1  49.66,5.97 90 top
SJ1  18.8,15.49 0 bottom
STEMMA  9.78,18.29 0 bottom
SW1  22.61,17.65 180 top
TP1  15.37,5.33 0 bottom
TP2  17.91,5.33 0 bottom
U1  41.66,11.94 0 top
U2  14.99,12.19 270 top
U3  10.67,5.33 90 top
U4  28.7,11.68 90 top
U$31  2.54,20.32 270 top
U$32  2.54,2.54 270 top
U$34  5.46,21.59 270 top
U$35  46.35,1.02 270 top
X1  26.16,4.57 0 top

### Tracks (layer width: path | path; a pad name or v marks a point on that pad's centre or on a via)
!RESET  (1 unrouted)
  Top 0.152: U4.40 22.98,12.93 22.43,13.48 19.54,13.48 18.29,14.73 18.29,16.66 18.55,16.92 20.54,16.92 SW1.1 SW1.3
+3V3  (13 unrouted)
  Top 0.305: U4.17 33.96,10.93 | 33.96,10.93 34.29,10.6 35.31,10.6 35.81,10.09 C5.2 | 33.96,10.93 33.98,10.93 36.58,13.53 C11.2 38.28,13.78 38.28,13.79 | 38.28,13.79 U1.8 U1.7 | I2C_PORT.2 44.75,14.61 43.6,13.46 38.61,13.46 38.28,13.79
A0  (via drill 0.25)
  Top 0.152: v26.93,5.93 26.93,7.55 U4.3
  Bottom 0.152: JP1.12 21.17,5.93 v26.93,5.93
A1  (via drill 0.25)  (1 unrouted)
  Top 0.152: v30.48,6.35 30.45,6.38 U4.10
  Bottom 0.152: JP1.11 23.23,5.45 27.21,5.45 28.77,7.01 29.59,7.01 30.25,6.35 v30.48,6.35
A2  (via drill 0.25)
  Top 0.152: v31.1,6.03 30.96,6.17 30.96,7.56 U4.11
  Bottom 0.152: JP1.10 25.46,5.14 27.34,5.14 28.88,6.68 29.46,6.68 30.28,5.87 30.93,5.87 v31.1,6.03
A3  (via drill 0.25)
  Top 0.152: v31.76,6.03 31.76,6.05 31.45,6.36 U4.12
  Bottom 0.152: JP1.9 24.14,1.51 28.97,6.34 29.38,6.34 30.3,5.42 31.16,5.42 31.76,6.01 v31.76,6.03
A4  (via drill 0.25)
  Top 0.152: U4.8 29.45,6.08 v29.2,5.83
  Bottom 0.152: JP1.8 26.67,3.3 v29.2,5.83
A5  (via drill 0.25)
  Top 0.152: v32.39,5.73 32.13,5.73 31.96,5.55 30.6,5.55 29.95,6.2 U4.9
  Bottom 0.152: v32.39,5.73 29.21,2.55 JP1.7
A6_VBATMON  (via drill 0.25)
  Top 0.152: v34.02,17.27 34.1,17.35 R6.1 R3.2 | U4.16 33.76,10.43 34.29,9.91 v34.8,9.91
  Bottom 0.152: v34.8,9.91 35.17,10.27 35.17,12.7 34.15,13.72 34.15,17.14 v34.02,17.27
A7_TS
  Top 0.152: U4.15 33.75,9.93 35.6,8.09 35.6,7.48 36.73,6.35 41.91,6.35 43.62,4.64 R9.1 43.69,4.57 44.7,5.59 44.73,5.56 45.41,5.56 46.53,4.45 47.42,4.45 47.55,4.57 47.97,4.57 48.44,5.04 48.44,5.7 RT1.2
A8_STEMMA  (1 unrouted)
AREF  (via drill 0.25)  (1 unrouted)
  Top 0.152: v27.44,6.36 27.44,7.56 U4.4
  Bottom 0.152: JP1.14 11.43,3.56 14.48,6.6 27.19,6.6 v27.44,6.36
AVCC  (via drill 0.25)
  Top 0.152: FB1.2 21.52,4.38 22.86,3.05 29.46,3.05 29.82,3.4 29.82,5.04 | U4.6 28.45,5.84 29.25,5.04 29.82,5.04 | 29.82,5.04 31.6,5.04 32.07,4.57 C9.2 34.02,5.75 v41.82,5.75 | RT1.1 49.05,5.02 48.3,4.27 47.67,4.27 47.55,4.14 46.15,4.14 v45.21,5.08
  Bottom 0.152: v41.82,5.75 44.54,5.75 v45.21,5.08
D0  (via drill 0.25)
  Top 0.152: U4.30 28.95,15.04 30.48,13.51 30.48,12.44 29.97,11.94 29.46,11.94 v28.19,10.67
  Bottom 0.152: JP1.3 37.34,3.3 35.56,3.3 31.88,6.99 30.61,6.99 28.19,9.4 v28.19,10.67
D1  (via drill 0.25)
  Top 0.152: U4.29 29.45,15.04 30.85,13.64 30.85,12.18 29.21,10.54 v29.21,10.41
  Bottom 0.152: JP1.2 33.02,10.16 29.46,10.16 v29.21,10.41
D2_FLASHMISO  (via drill 0.25)
  Top 0.152: U4.22 35.19,13.43 v35.42,13.21 | v40.89,11.18 41.02,11.05 U1.2
  Bottom 0.152: v35.42,13.21 38.86,13.21 v40.89,11.18
D3_FLASHSCK
  Top 0.152: U4.24 33.28,14.43 35.81,16.97 38.86,16.97 39.17,17.27 41.4,17.27 42.29,16.38 U1.6
D4_FLASHMOSI  (via drill 0.25)
  Top 0.152: U4.23 34.02,13.93 34.82,14.73 37.32,14.73 39.35,16.76 v40.39,16.76 | U1.5 43.56,16.13 v42.93,16.76
  Bottom 0.152: v42.93,16.76 v40.39,16.76
D5
  Top 0.152: U4.25 33.28,15.8 35.03,17.55 35.03,19.26 35.54,19.77 37.55,19.77 JP3.10
D6
  Top 0.152: JP3.9 36.32,21.59 34.49,19.76 31.71,19.76 31.32,19.38 31.32,17.44 30.95,17.07 U4.26
D8_NEOPIX
  Top 0.152: U4.37 23.82,14.43 23.57,14.18 19.97,14.18 19.15,15 NEOPIX.1
D9
  Top 0.152: JP3.8 32.89,20.19 31.37,20.19 30.89,19.72 30.89,17.7 30.48,17.28 30.48,15.83 U4.27
D10
  Top 0.152: JP3.7 31.44,21.59 29.21,19.36 29.21,17.53 29.97,16.76 29.97,15.82 U4.28
D11  (via drill 0.25)
  Top 0.152: v26.92,10.92 26.92,10.74 28.89,8.78 v29.49,8.78 | v31.5,8.81 31.62,8.93 U4.13
  Bottom 0.152: JP3.6 29.21,13.21 v26.92,10.92 | v31.5,8.81 31.46,8.78 v29.49,8.78
D12  (via drill 0.25)
  Top 0.152: v27.69,12.7 27.69,10.41 28.67,9.43 v28.96,9.43 | U4.14 v31.75,9.43
  Bottom 0.152: JP3.5 28.7,19.56 28.7,13.72 v27.69,12.7 | v31.75,9.43 v28.96,9.43
D13  (2 unrouted)
EN  (2 unrouted)
FLASH_CS  (via drill 0.25)  (1 unrouted)
  Top 0.152: R5.1 39.18,4.57 v39.88,5.27 | v39.88,7.11 39.75,7.24 U1.1
  Bottom 0.152: v39.88,5.27 v39.88,7.11
GND  (4 unrouted)
  pour Top: 0,22.86 0,0 45.85,0 45.85,10.41 50.93,10.41 50.93,22.86
  pour Bottom: 45.85,0 0,0 0,22.86 50.93,22.86 50.93,10.41 45.85,10.41
MISO  (1 unrouted)
MOSI  (1 unrouted)
N$1  (1 unrouted)
N$2  (1 unrouted)
N$3  (1 unrouted)
PROG  (1 unrouted)
SCK  (1 unrouted)
SCL  (via drill 0.25)
  Top 0.152: v33.66,15.49 35.43,17.27 38.74,17.27 39.04,17.58 40.18,17.58 41.91,19.3 | U4.32 27.95,14.97 29.21,13.72 29.21,12.95 v29.72,12.45 | JP3.11 41.91,19.3 | I2C_PORT.4 44.6,16.61 41.91,19.3
  Bottom 0.152: v29.72,12.45 29.79,12.45 30.51,13.17 31.33,13.17 v33.66,15.49
SDA  (via drill 0.25)
  Top 0.152: 46.35,15.61 I2C_PORT.3 46.63,15.61 46.98,15.96 46.98,16.78 v44.45,19.3 JP3.12 | U4.31 28.45,14.9 29.52,13.84 29.52,13.41 v29.72,13.21
  Bottom 0.152: v29.72,13.21 29.72,13.72 35.31,19.3 v44.45,19.3
STAT  (1 unrouted)
SWCLK  (1 unrouted)
SWDIO  (1 unrouted)
USB_N  (via drill 0.25)
  Top 0.152: J2.2 7.99,12.08 8.89,11.18 10.03,11.18 v10.41,11.56 | v27.81,14.35 27.45,14.71 U4.33
  Bottom 0.152: v10.41,11.56 10.79,11.18 24.38,11.18 27.56,14.35 v27.81,14.35
USB_P  (via drill 0.25)
  Top 0.152: J2.3 8.21,11.43 8.76,10.87 9.96,10.87 v10.41,10.41 | v26.67,12.7 26.95,12.98 U4.34
  Bottom 0.152: v10.41,10.41 10.79,10.79 24.77,10.79 v26.67,12.7
USBID  (via drill 0.25)
  Top 0.152: U4.39 23.4,13.43 v23.37,13.46 | v5.84,10.92 5.7,10.78 J2.4
  Bottom 0.152: v5.84,10.92 7.98,13.06 12.37,13.06 13.03,13.72 23.11,13.72 v23.37,13.46
V+  (1 unrouted)
  Top 0.305: R10.1 D1.C 7.48,9.97 Q1.2 9.77,9.97 C6.1 12.63,9.14 R1.1
VBACKUP  (via drill 0.25)  (1 unrouted)
  Top 0.152: U4.48 25.7,8.93 v25.91,9.14
  Bottom 0.152: v25.91,9.14 28.7,11.94 B2.+
VBAT  (via drill 0.3)  (2 unrouted)
  Top 0.305: J1.2 11.67,15.48 11.67,11.18 Q1.3 11.43,10.91 v11.43,9.91 | U3.3 11.97,6.41 12.67,7.11 v12.7,7.11 13.78,7.11 C3.1
  Bottom 0.305: v11.43,9.91 11.43,8.38 v12.7,7.11
VBUS  (via drill 0.3)  (2 unrouted)
  Top 0.152: 9.4,11.87 Q1.1
  Top 0.305: J2.1 5.51,14.04 D1.A 7.23,14.04 v8.73,12.54 9.4,11.87 | v8.82,7.04 8.82,6.83 U3.4
  Bottom 0.305: v8.73,12.54 8.73,7.13 v8.82,7.04
VDDCORE  (via drill 0.25)
  Top 0.152: U4.41 21.79,12.43 C1.1 20.45,11.49 v20.45,9.63
  Bottom 0.152: v20.45,9.63 20.45,9.25 L1.P$1
VSW  (via drill 0.25)
  Top 0.152: U4.43 23.36,11.43 v23.11,11.68
  Bottom 0.152: v23.11,11.68 21.61,11.68 L1.P$2
XIN32
  Top 0.152: U4.1 25.95,5.56 X1.P$2 23.68,4.57 C4.1
XOUT32
  Top 0.152: U4.2 26.45,5.48 X1.P$1 27.87,4.06 C2.1

### Text on the board
tPlace: BAT | En | USB | 13 | 12 | 11 | 10 | 9 | 6 | 5 | SCL | SDA | Rs | 3V | ARf | GND | A0 | A1 | A2 | A3 | A4 | A5 | SCK | MO | MI | RX | TX | VBk
bPlace: En | 13 | 12 | 6 | ~ | 5 | SCL | SDA | BAT | USB | 11~ | 10~ | 9~ | swclk | swdio | SCK | MOSI | MISO | RST | 3V | ARf | GND | A0 | A1 | A2 | A3 | A4 | A5 | RX | TX | GND